# EAGLE design placa_for_v41 (EAGLE 7.2.0)
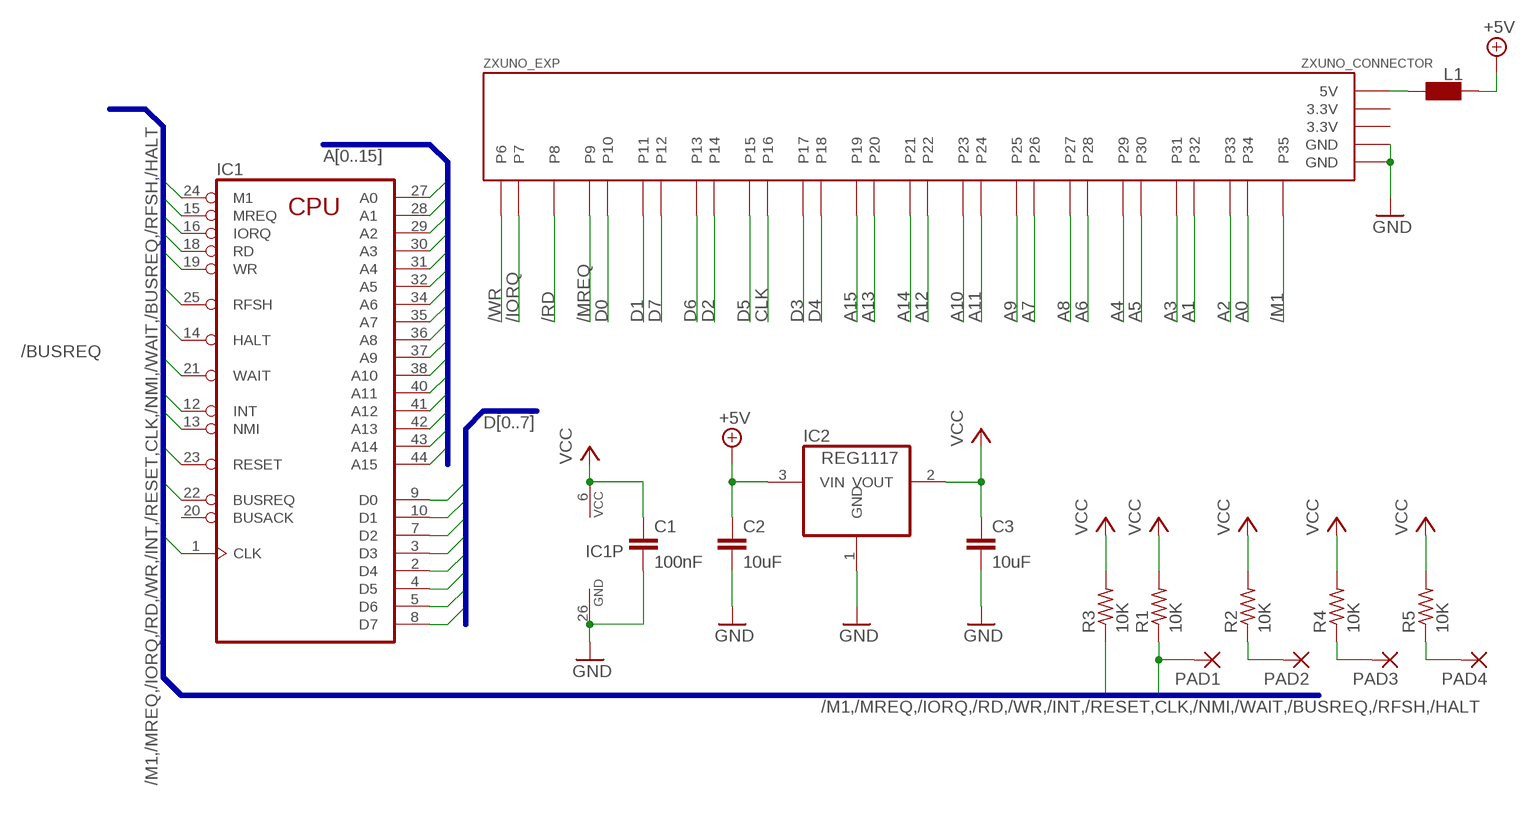
[diagram p0: schematic, sheet 1]

## Parts
C1  100nF  C-EUC0805K  [C0805K]
C2  10uF  C-EUC0805K  [C0805K]
C3  10uF  C-EUC0805K  [C0805K]
IC1  Z80CPU-F  [QFP-44]
IC2  REG1117  [SOT223]
L1  WE-CBF_0805  [0805]
PAD1  SMD5  [SMD2,54-5,08]
PAD2  SMD5  [SMD2,54-5,08]
PAD3  SMD5  [SMD2,54-5,08]
PAD4  SMD5  [SMD2,54-5,08]
R1  10K  R-US_R0805  [R0805]
R2  10K  R-US_R0805  [R0805]
R3  10K  R-US_R0805  [R0805]
R4  10K  R-US_R0805  [R0805]
R5  10K  R-US_R0805  [R0805]
ZXUNO_EXP  ZXUNO_CONNECTOR  [ZXUNO_CONNECTOR]

## Nets
+5V [power]: C2.1 IC2.3(VIN) L1.2
/BUSREQ: IC1.22(BUSREQ) R3.1
/HALT: IC1.14(HALT)
/INT: IC1.12(INT)
/IORQ: IC1.16(IORQ) ZXUNO_EXP.P7
/M1: IC1.24(M1) ZXUNO_EXP.P35
/MREQ: IC1.15(MREQ) ZXUNO_EXP.P9
/NMI: IC1.13(NMI)
/RD: IC1.18(RD) ZXUNO_EXP.P8
/RESET: IC1.23(RESET)
/RFSH: IC1.25(RFSH)
/WAIT: IC1.21(WAIT) PAD1.1(P) R1.1
/WAIT1: PAD2.1(P) R2.1
/WAIT2: PAD3.1(P) R4.1
/WAIT3: PAD4.1(P) R5.1
/WR: IC1.19(WR) ZXUNO_EXP.P6
A0: IC1.27(A0) ZXUNO_EXP.P34
A1: IC1.28(A1) ZXUNO_EXP.P32
A2: IC1.29(A2) ZXUNO_EXP.P33
A3: IC1.30(A3) ZXUNO_EXP.P31
A4: IC1.31(A4) ZXUNO_EXP.P29
A5: IC1.32(A5) ZXUNO_EXP.P30
A6: IC1.34(A6) ZXUNO_EXP.P28
A7: IC1.35(A7) ZXUNO_EXP.P26
A8: IC1.36(A8) ZXUNO_EXP.P27
A9: IC1.37(A9) ZXUNO_EXP.P25
A10: IC1.38(A10) ZXUNO_EXP.P23
A11: IC1.40(A11) ZXUNO_EXP.P24
A12: IC1.41(A12) ZXUNO_EXP.P22
A13: IC1.42(A13) ZXUNO_EXP.P20
A14: IC1.43(A14) ZXUNO_EXP.P21
A15: IC1.44(A15) ZXUNO_EXP.P19
CLK: IC1.1(CLK) ZXUNO_EXP.P16
D0: IC1.9(D0) ZXUNO_EXP.P10
D1: IC1.10(D1) ZXUNO_EXP.P11
D2: IC1.7(D2) ZXUNO_EXP.P14
D3: IC1.3(D3) ZXUNO_EXP.P17
D4: IC1.2(D4) ZXUNO_EXP.P18
D5: IC1.4(D5) ZXUNO_EXP.P15
D6: IC1.5(D6) ZXUNO_EXP.P13
D7: IC1.8(D7) ZXUNO_EXP.P12
GND [power]: C1.2 C2.2 C3.2 IC1.26(GND) IC2.1(GND) ZXUNO_EXP.GND@1(GND) ZXUNO_EXP.GND@2(GND)
N$1: L1.1 ZXUNO_EXP.5V
VCC [power]: C1.1 C3.1 IC1.6(VCC) IC2.2(VOUT) R1.2 R2.2 R3.2 R4.2 R5.2
Unconnected: IC1.11(NC) IC1.17(NC) IC1.20(BUSACK) IC1.33(NC) IC1.39(NC)

## Buses
A[0..15]
D[0..7]
/M1,/MREQ,/IORQ,/RD,/WR,/INT,/RESET,CLK,/NMI,/WAIT,/BUSREQ,/RFSH,/HALT

## Power pins joined to a net without a drawn wire
3.3V: ZXUNO_EXP.3.3V@1(3.3V) ZXUNO_EXP.3.3V@2(3.3V)

## Library data of the parts
C1-C3 = rcl:C-EU: CAPACITOR, European symbol
IC1 = Z80FAMIL:Z80CPU-F
IC2 = burr-brown:REG1117: 800mA and 1A Low Dropout (LDO) Positive Regulator 1.8V, 2.5V, 2.85V, 3.3V, 5V, and Adj
L1 = wuerth-elektronik:WE-CBF: SMD EMI Suppression Ferrite Beads - excellent anti-EMI properties - low DCR - impedances till 3000 ohms - rated current up to 6 A
PAD1-PAD4 = wirepad:SMD5: SMD PAD
R1-R5 = rcl:R-US_: RESISTOR, American symbol
ZXUNO_EXP = zxuno:ZXUNO_CONNECTOR

## Net classes
0 default: width 0.203 mm, clearance 0.203 mm
1 power: width 0.406 mm, clearance 0.203 mm to class 0, clearance 0.203 mm

## Board
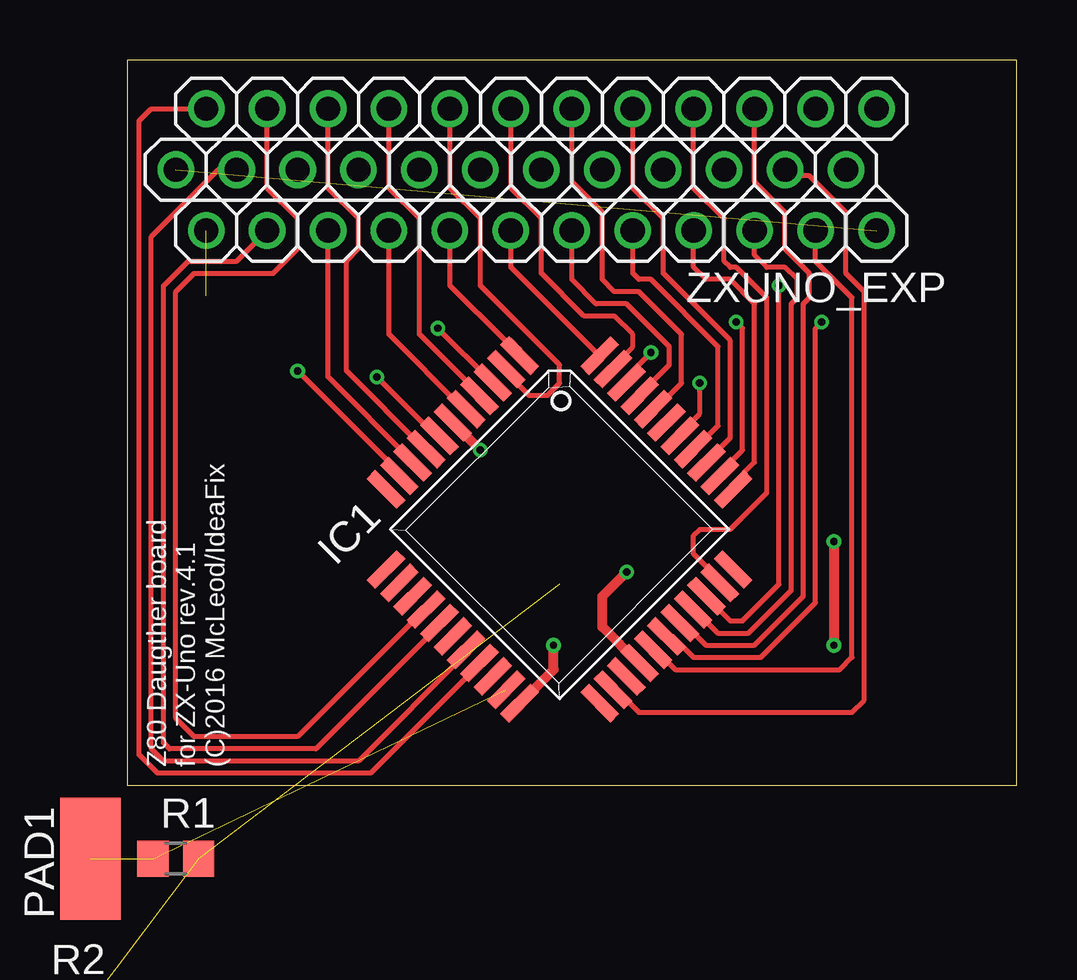
[diagram p1: board, top side]
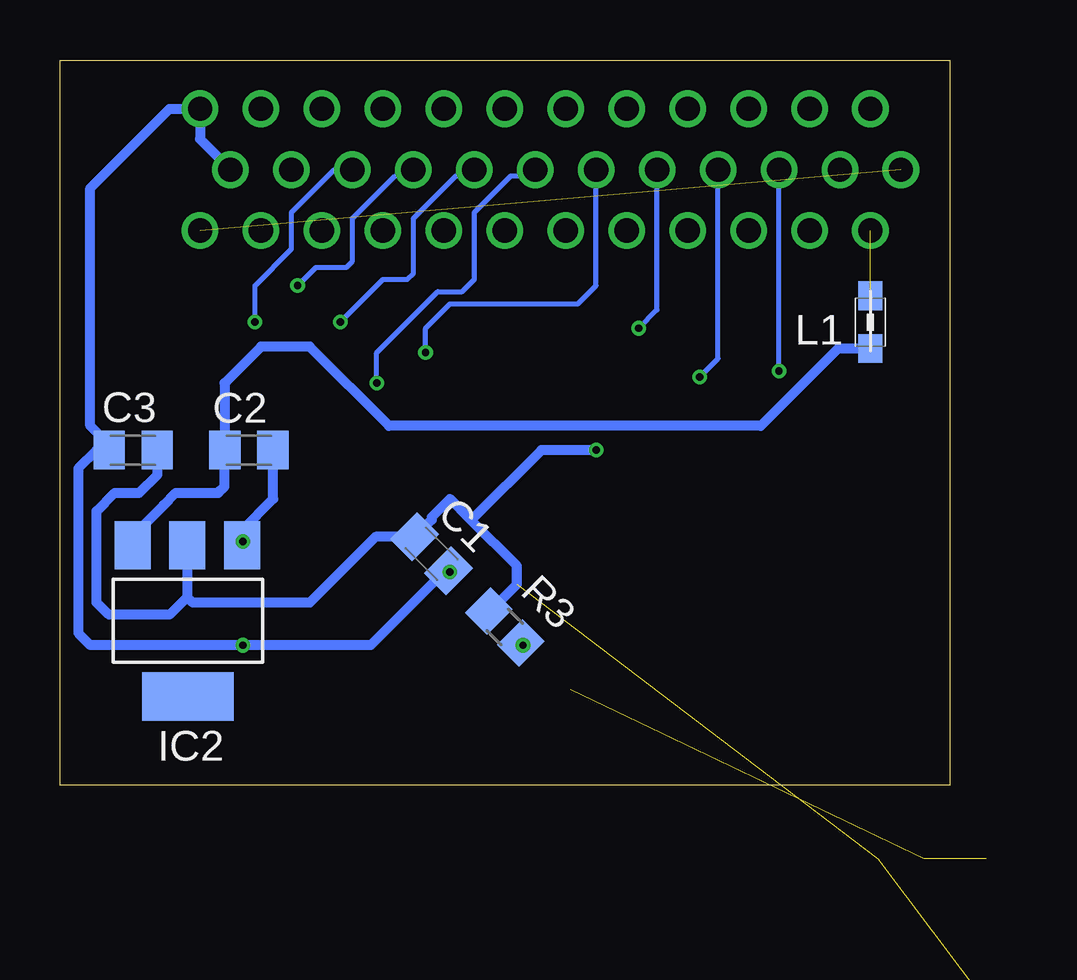
[diagram p2: board, bottom side, seen from below]

Size 37.08 x 30.23 mm. Coordinates in mm from the lower left corner, seen from the top.
Outline: 0,0 37.08,0 37.08,30.23 0,30.23 0,0
Copper layers (1*16): Top 0.035mm / dielectric 1.5mm / Bottom 0.035mm
Design rules "ITEADstudio_DRC": minimum track width 6mil, minimum drill 12mil, track to track 6mil, track to pad 6mil, pad to pad 6mil, via to via 6mil, smd to smd 0mil, copper to edge 10mil, drill to drill 10mil, minimum pad ring 10mil, minimum via ring 6mil, stop-mask expansion 2mil, vias tented up to drill 100mil, thermal gap 10mil

### Footprints (pad centres in the part's own frame; a part is rotated, then mirrored left to right if it is on the bottom)
C0805K = smd 1.3 x 1.6: 1 -1,0; 2 1,0
QFP-44 = smd 0.508 x 1.778: 1 -3.937,-6.299; 2 -3.15,-6.299; 3 -2.362,-6.299; 4 -1.575,-6.299; 5 -0.787,-6.299; 6 0,-6.299; 7 0.787,-6.299; 8 1.575,-6.299; 9 2.362,-6.299; 10 3.15,-6.299; 11 3.937,-6.299; 23 3.937,6.299; 24 3.15,6.299; 25 2.362,6.299; 26 1.575,6.299; 27 0.787,6.299; 28 0,6.299; 29 -0.787,6.299; 30 -1.575,6.299; 31 -2.362,6.299; 32 -3.15,6.299; 33 -3.937,6.299 | smd 1.778 x 0.508: 12 6.299,-3.937; 13 6.299,-3.15; 14 6.299,-2.362; 15 6.299,-1.575; 16 6.299,-0.787; 17 6.299,0; 18 6.299,0.787; 19 6.299,1.575; 20 6.299,2.362; 21 6.299,3.15; 22 6.299,3.937; 34 -6.299,3.937; 35 -6.299,3.15; 36 -6.299,2.362; 37 -6.299,1.575; 38 -6.299,0.787; 39 -6.299,0; 40 -6.299,-0.787; 41 -6.299,-1.575; 42 -6.299,-2.362; 43 -6.299,-3.15; 44 -6.299,-3.937
SOT223 = smd 1.499 x 2.007: 1 -2.261,-3.15; 2 0.025,-3.15; 3 2.311,-3.15 | smd 3.81 x 2.007: 4 0,3.15
0805 = smd 1.2 x 1: 1 -1.1,0; 2 1.1,0
SMD2,54-5,08 = smd 2.54 x 5.08: 1 0,0
R0805 = smd 1.3 x 1.5: 1 -0.95,0; 2 0.95,0
ZXUNO_CONNECTOR = drill 1.016: 3.3V@1 -13.97,0; 3.3V@2 15.24,-2.54; 5V -12.7,-2.54; GND@1 15.24,2.54; GND@2 13.97,0; NC@1 12.7,2.54; P6 -12.7,2.54; P7 -10.16,-2.54; P8 -11.43,0; P9 -10.16,2.54; P10 -7.62,-2.54; P11 -8.89,0; P12 -7.62,2.54; P13 -5.08,-2.54; P14 -6.35,0; P15 -5.08,2.54; P16 -2.54,-2.54; P17 -3.81,0; P18 -2.54,2.54; P19 0,-2.54; P20 -1.27,0; P21 0,2.54; P22 2.54,-2.54; P23 1.27,0; P24 2.54,2.54; P25 5.08,-2.54; P26 3.81,0; P27 5.08,2.54; P28 7.62,-2.54; P29 6.35,0; P30 7.62,2.54; P31 10.16,-2.54; P32 8.89,0; P33 10.16,2.54; P34 12.7,-2.54; P35 11.43,0

### Placement (x,y rotation side)
C1  21.59,9.65 315 bottom
C2  29.21,13.97 0 bottom
C3  34.04,13.97 180 bottom
IC1  18.03,10.67 225 top
IC2  31.75,6.86 180 bottom
L1  3.3,19.3 270 bottom
PAD1  -1.52,-3.05 0 top  (outside the outline)
PAD2  -1.52,-14.99 0 top  (outside the outline)
PAD3  -1.52,-26.92 0 top  (outside the outline)
PAD4  -1.52,-38.86 0 top  (outside the outline)
R1  2.03,-3.05 0 top  (outside the outline)
R2  -2.54,-9.14 0 top  (outside the outline)
R3  18.54,6.6 135 bottom
R4  -2.54,-21.08 0 top  (outside the outline)
R5  -2.54,-33.02 0 top  (outside the outline)
ZXUNO_EXP  16,25.65 0 top

### Tracks (layer width: path | path; a pad name or v marks a point on that pad's centre or on a via)
3.3V  (1 unrouted)
+5V
  Bottom 0.406: L1.2 4.66,18.2 7.87,14.99 23.37,14.99 26.67,18.29 28.7,18.29 30.23,16.76 30.23,13.99 C2.1 30.23,13.95 30.23,12.45 30.48,12.19 32.26,12.19 32.77,11.68 34.06,10.39 IC2.3
/BUSREQ  (via drill 0.3 pad 0.61)
  Top 0.406: IC1.22 16.38,3.43 17.27,4.32 17.78,4.83 v17.78,5.84
  Bottom 0.406: v17.78,5.84 | v17.78,5.84 R3.1
/IORQ
  Top 0.203: IC1.16 13.02,6.67 7.87,1.52 1.78,1.52 1.52,1.78 1.52,20.83 2.54,21.84 4.57,21.84 ZXUNO_EXP.P7
/M1
  Top 0.203: IC1.24 20.4,3.99 21.34,3.05 30.23,3.05 30.73,3.56 30.73,20.57 29.97,21.34 29.97,23.88 28.45,25.4 27.69,25.4 ZXUNO_EXP.P35
/MREQ
  Top 0.203: IC1.15 12.41,7.33 7.11,2.03 2.79,2.03 2.03,2.79 2.03,20.57 2.79,21.34 6.1,21.34 7.11,22.35 7.11,23.62 5.84,24.89 ZXUNO_EXP.P9
/RD
  Top 0.203: IC1.18 14.14,5.5 9.65,1.02 1.52,1.02 1.02,1.52 1.02,22.86 3.81,25.65 ZXUNO_EXP.P8
/WAIT  (2 unrouted)
/WAIT1  (1 unrouted)
/WAIT2  (1 unrouted)
/WAIT3  (1 unrouted)
/WR
  Top 0.203: IC1.19 14.69,5.04 10.16,0.51 1.27,0.51 0.51,1.27 0.51,27.69 1.02,28.19 ZXUNO_EXP.P6
A0
  Top 0.203: IC1.27 22.03,5.66 22.86,4.83 29.72,4.83 30.23,5.33 30.23,20.32 28.7,21.84 ZXUNO_EXP.P34
A1  (via drill 0.3 pad 0.61)
  Top 0.203: IC1.28 22.74,6.21 23.62,5.33 26.42,5.33 28.7,7.62 28.7,19.05 v28.96,19.3
  Bottom 0.203: v28.96,19.3 28.96,20.83 27.43,22.35 27.43,23.88 25.65,25.65 ZXUNO_EXP.P32
A2
  Top 0.203: IC1.29 23.2,6.77 24.13,5.84 26.16,5.84 28.19,7.87 28.19,20.07 28.45,20.32 28.45,21.34 27.43,22.35 27.43,23.88 26.16,25.15 ZXUNO_EXP.P33
A3
  Top 0.203: IC1.30 23.66,7.33 24.64,6.35 25.91,6.35 27.69,8.13 27.69,20.07 27.94,20.32 27.94,21.08 27.43,21.59 26.67,21.59 26.16,22.1 ZXUNO_EXP.P31
A4  (via drill 0.3 pad 0.61)
  Top 0.203: IC1.31 24.16,7.84 25.15,6.86 25.65,6.86 27.18,8.38 v27.18,20.83
  Bottom 0.203: v27.18,20.83 26.42,21.59 25.15,21.59 24.89,21.84 24.89,23.62 23.11,25.4 22.61,25.4 ZXUNO_EXP.P29
A5
  Top 0.203: IC1.32 24.71,8.56 23.62,9.65 23.62,10.41 23.88,10.67 25.15,10.67 26.67,12.19 26.67,20.32 25.4,21.59 25.15,21.59 24.89,21.84 24.89,23.62 23.62,24.89 ZXUNO_EXP.P30
A6
  Top 0.203: IC1.34 25.27,12.57 26.16,13.46 26.16,20.07 25.15,21.08 24.13,21.08 23.62,21.59 ZXUNO_EXP.P28
A7  (via drill 0.3 pad 0.61)
  Top 0.203: IC1.35 24.71,13.03 25.65,13.97 25.65,19.05 v25.4,19.3
  Bottom 0.203: v25.4,19.3 23.62,21.08 22.61,21.08 22.35,21.34 22.35,23.62 20.57,25.4 20.07,25.4 ZXUNO_EXP.P26
A8
  Top 0.203: IC1.36 24.16,13.49 25.15,14.48 25.15,18.54 22.35,21.34 22.35,23.62 21.08,24.89 ZXUNO_EXP.P27
A9
  Top 0.203: IC1.37 23.66,14.01 24.64,14.99 24.64,18.29 21.84,21.08 21.34,21.08 21.08,21.34 ZXUNO_EXP.P25
A10  (via drill 0.3 pad 0.61)
  Top 0.203: IC1.38 23.05,14.66 23.88,15.49 v23.88,16.76
  Bottom 0.203: v23.88,16.76 23.88,18.03 21.34,20.57 20.32,20.57 19.81,21.08 19.81,23.88 18.29,25.4 17.53,25.4 ZXUNO_EXP.P23
A11
  Top 0.203: IC1.40 22.03,15.68 23.11,16.76 23.11,18.8 21.34,20.57 20.32,20.57 19.81,21.08 19.81,23.88 18.54,25.15 ZXUNO_EXP.P24
A12
  Top 0.203: IC1.41 21.38,16.3 22.61,17.53 22.61,18.29 20.83,20.07 19.56,20.07 18.54,21.08 ZXUNO_EXP.P22
A13  (via drill 0.3 pad 0.61)
  Top 0.203: IC1.42 20.82,17.01 v21.84,18.03
  Bottom 0.203: v21.84,18.03 21.84,19.05 20.83,20.07 15.49,20.07 14.73,20.83 ZXUNO_EXP.P20
A14
  Top 0.203: IC1.43 20.26,17.47 21.08,18.29 21.08,18.8 20.32,19.56 19.05,19.56 17.27,21.34 17.27,23.62 16,24.89 ZXUNO_EXP.P21
A15
  Top 0.203: IC1.44 19.69,17.91 16,21.59 ZXUNO_EXP.P19
CLK
  Top 0.203: IC1.1 16.36,18.18 16,18.54 15.75,18.54 13.46,20.83 ZXUNO_EXP.P16
D0
  Top 0.203: IC1.9 11.91,13.49 8.38,17.02 ZXUNO_EXP.P10
D1  (via drill 0.3 pad 0.61)
  Top 0.203: IC1.10 11.35,13.03 v7.11,17.27
  Bottom 0.203: v7.11,17.27 ZXUNO_EXP.P11
D2  (via drill 0.3 pad 0.61)
  Top 0.203: IC1.7 13.02,14.66 12.77,14.66 v10.41,17.02
  Bottom 0.203: v10.41,17.02 9.65,17.78 ZXUNO_EXP.P14
D3  (via drill 0.3 pad 0.61)
  Top 0.203: IC1.3 15.21,16.79 v12.95,19.05
  Bottom 0.203: v12.95,19.05 12.19,19.81 ZXUNO_EXP.P17
D4
  Top 0.203: IC1.2 15.67,17.35 16.76,16.26 17.53,16.26 18.03,16.76 18.03,17.53 14.73,20.83 14.73,23.62 13.46,24.89 ZXUNO_EXP.P18
D5
  Top 0.203: IC1.4 14.69,16.3 12.19,18.8 12.19,23.62 10.92,24.89 ZXUNO_EXP.P15
D6
  Top 0.203: IC1.5 14.04,15.68 10.92,18.8 ZXUNO_EXP.P13
D7
  Top 0.203: IC1.8 12.41,14.01 9.14,17.27 9.14,21.84 9.65,22.35 9.65,23.62 8.38,24.89 ZXUNO_EXP.P12
GND  (via drill 0.3 pad 0.61)
  Top 0.406: IC1.26 21.32,5.1 19.81,6.6 19.81,7.87 v20.83,8.89 | v29.46,10.16 v29.46,5.84
  Bottom 0.203: C3.2 35.56,13.97
  Bottom 0.406: 29.49,10.19 IC2.1 29.49,9.93 29.46,9.91 | C2.2 28.19,13.95 28.19,11.94 29.49,10.64 29.49,10.19 | v20.83,8.89 | v20.83,8.89 C1.2 21.03,8.95 24.13,5.84 v29.46,5.84 | C3.2 35.04,14.21 35.81,14.99 35.81,24.89 32.51,28.19 ZXUNO_EXP.GND@1 31.24,26.92 ZXUNO_EXP.GND@2 | v29.46,5.84 35.81,5.84 36.32,6.35 36.32,13.21 35.56,13.97 | 29.49,10.19 v29.46,10.16 | 28.19,5.84 v29.46,5.84
N$1  (1 unrouted)
VCC  (via drill 0.3 pad 0.61)  (4 unrouted)
  Top 0.406: IC1.6 | IC1.6 | IC1.6 v14.73,13.97
  Bottom 0.406: IC2.2 31.77,7.85 | 31.77,7.85 32.51,7.11 35.05,7.11 35.56,7.62 35.56,11.43 34.8,12.19 33.78,12.19 33.02,12.95 33.02,13.95 C3.1 | R3.2 19.14,7.28 18.03,8.38 18.03,9.14 19.94,11.05 | 19.94,11.05 20.83,11.94 21.59,11.18 21.59,11.07 C1.1 23.93,10.36 26.67,7.62 31.55,7.62 31.77,7.85 | v14.73,13.97 17.02,13.97 19.94,11.05

### Text on the board
tNames: Z80 Daugther board / for ZX-Uno rev.4.1 / (C)2016 McLeod/IdeaFix